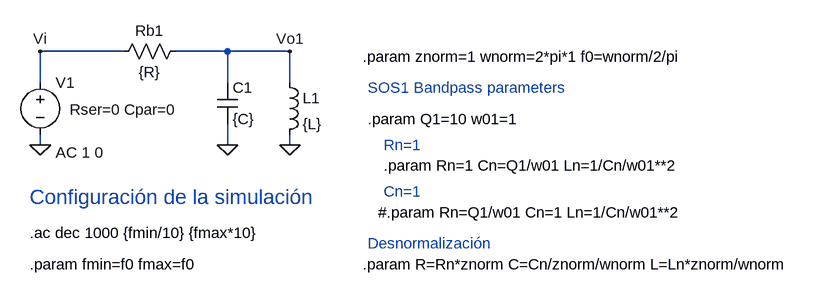
[diagram p0: schematic bandpass pasivo simple parametrizado.asc]
bandpass pasivo simple parametrizado.asc, the LTspice schematic file:
Version 4
SHEET 1 1512 856
WIRE -16 96 -144 96
WIRE 144 96 64 96
WIRE 240 96 144 96
WIRE -144 144 -144 96
WIRE 144 144 144 96
WIRE 240 144 240 96
WIRE -144 240 -144 224
WIRE 144 240 144 208
WIRE 240 240 240 224
FLAG 240 240 0
FLAG 144 240 0
FLAG 240 96 Vo1
FLAG -144 240 0
FLAG -144 96 Vi
SYMBOL res 80 80 R90
WINDOW 0 0 56 VBottom 2
WINDOW 3 32 56 VTop 2
SYMATTR InstName Rb1
SYMATTR Value {R}
SYMBOL ind 224 128 R0
SYMATTR InstName L1
SYMATTR Value {L}
SYMBOL cap 128 144 R0
SYMATTR InstName C1
SYMATTR Value {C}
SYMBOL voltage -144 128 R0
WINDOW 123 24 124 Left 2
WINDOW 39 45 58 Left 2
SYMATTR Value2 AC 1 0
SYMATTR SpiceLine Rser=0 Cpar=0
SYMATTR InstName V1
SYMATTR Value ""
TEXT -160 376 Left 2 !.ac dec 1000 {fmin/10} {fmax*10}
TEXT 352 104 Left 2 !.param znorm=1 wnorm=2*pi*1 f0=wnorm/2/pi
TEXT -160 320 Left 3 ;Configuración de la simulación
TEXT 360 200 Left 2 !.param Q1=10 w01=1
TEXT 360 152 Left 2 ;SOS1 Bandpass parameters
TEXT -160 424 Left 2 !.param fmin=f0 fmax=f0
TEXT 384 272 Left 2 !.param Rn=1 Cn=Q1/w01 Ln=1/Cn/w01**2
TEXT 352 424 Left 2 !.param R=Rn*znorm C=Cn/znorm/wnorm L=Ln*znorm/wnorm
TEXT 376 344 Left 2 !#.param Rn=Q1/w01 Cn=1 Ln=1/Cn/w01**2
TEXT 384 240 Left 2 ;Rn=1
TEXT 384 312 Left 2 ;Cn=1
TEXT 360 392 Left 2 ;Desnormalización

The netlist it stands for:
* bandpass pasivo simple parametrizado.asc
Rb1 Vo1 Vi {R}
L1 Vo1 0 {L}
C1 Vo1 0 {C}
V1 Vi 0 AC 1 0 Rser=0 Cpar=0
.ac dec 1000 {fmin/10} {fmax*10}
.param znorm=1 wnorm=2*pi*1 f0=wnorm/2/pi
* Configuración de la simulación
.param Q1=10 w01=1
* SOS1 Bandpass parameters
.param fmin=f0 fmax=f0
.param Rn=1 Cn=Q1/w01 Ln=1/Cn/w01**2
.param R=Rn*znorm C=Cn/znorm/wnorm L=Ln*znorm/wnorm
#.param Rn=Q1/w01 Cn=1 Ln=1/Cn/w01**2
* Rn=1
* Cn=1
* Desnormalización
.backanno
.end